# EAGLE design Controller (EAGLE 5.10)
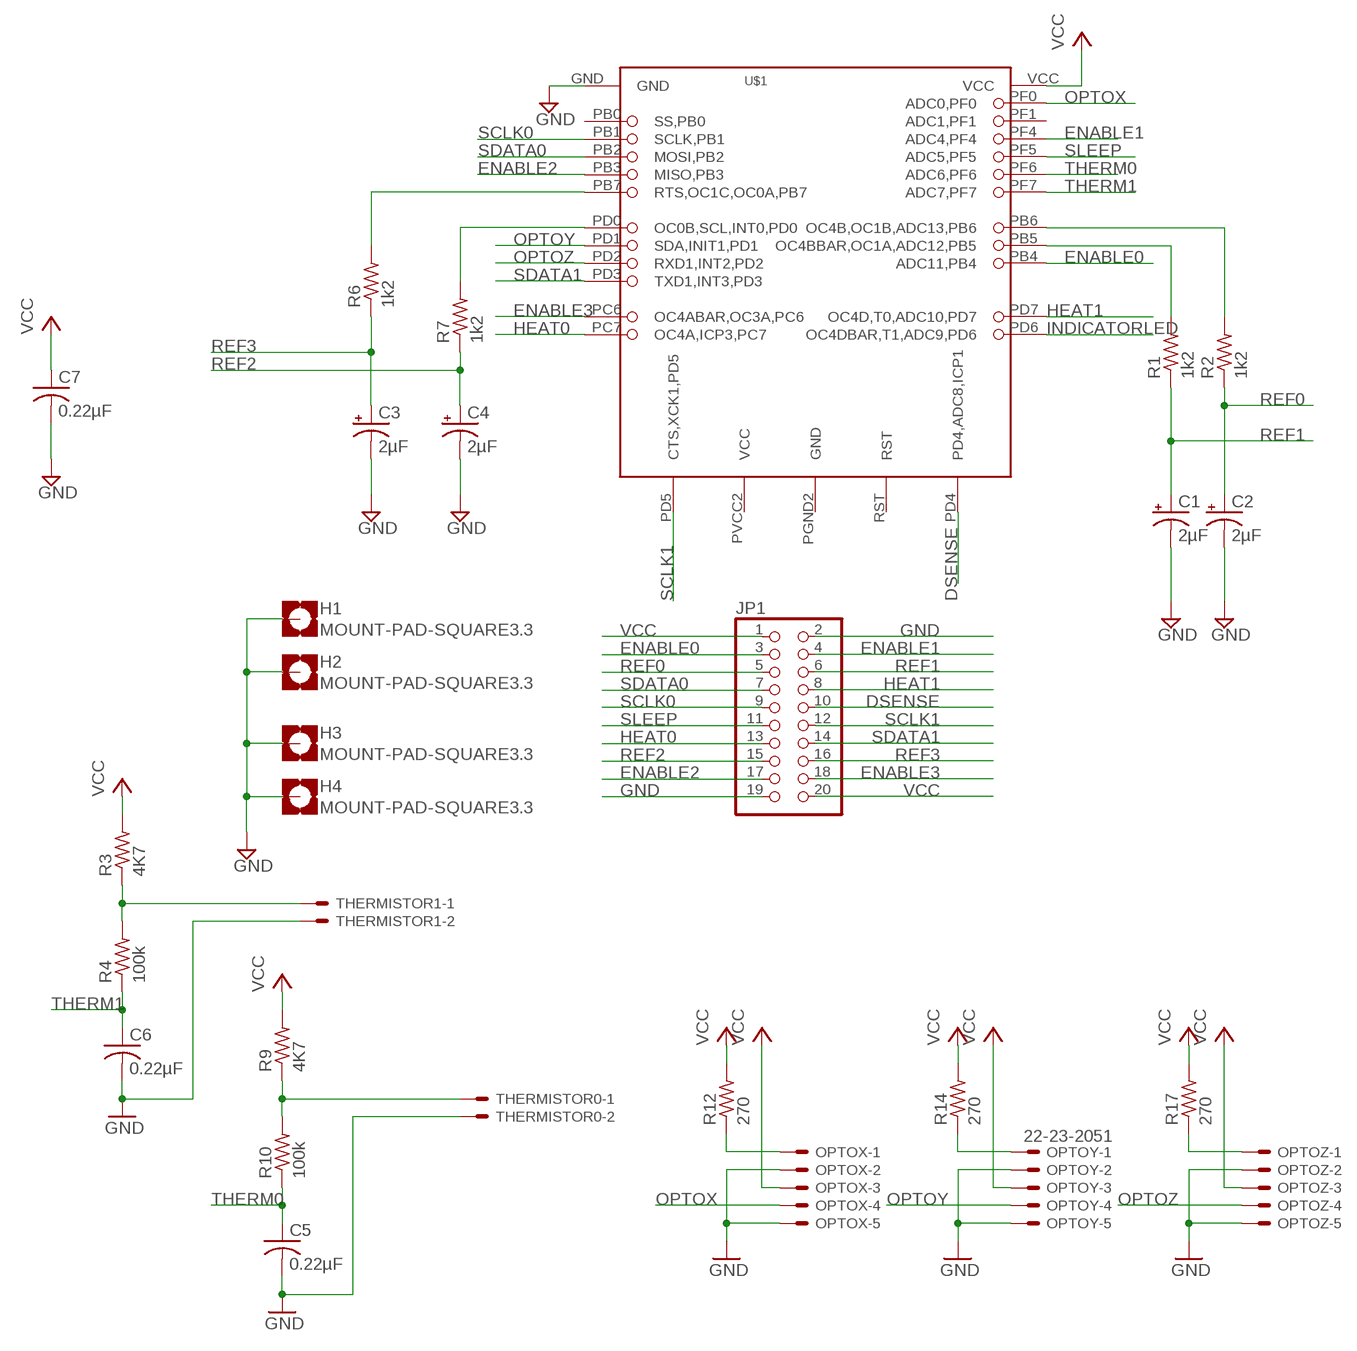
[diagram p0: schematic, sheet 1]

## Parts
C1  2µF  CPOL-USE2-5  [E2-5]
C2  2µF  CPOL-USE2-5  [E2-5]
C3  2µF  CPOL-USE2-5  [E2-5]
C4  2µF  CPOL-USE2-5  [E2-5]
C5  0.22µF  C-US050-025X075  [C050-025X075]
C6  0.22µF  C-US050-025X075  [C050-025X075]
C7  0.22µF  C-US050-025X075  [C050-025X075]
H1  MOUNT-PAD-SQUARE3.3  [3,3-PAD-SQUARE]
H2  MOUNT-PAD-SQUARE3.3  [3,3-PAD-SQUARE]
H3  MOUNT-PAD-SQUARE3.3  [3,3-PAD-SQUARE]
H4  MOUNT-PAD-SQUARE3.3  [3,3-PAD-SQUARE]
JP1  PINHD-2X10  [2X10]
OPTOX  22-23-2051  [22-23-2051]
OPTOY  22-23-2051  [22-23-2051]
OPTOZ  22-23-2051  [22-23-2051]
R1  1k2  R-US_0207/7  [0207/7]
R2  1k2  R-US_0207/7  [0207/7]
R3  4K7  R-US_0207/7  [0207/7]
R4  100k  R-US_0207/7  [0207/7]
R6  1k2  R-US_0207/7  [0207/7]
R7  1k2  R-US_0207/7  [0207/7]
R9  4K7  R-US_0207/7  [0207/7]
R10  100k  R-US_0207/7  [0207/7]
R12  270  R-US_0207/7  [0207/7]
R14  270  R-US_0207/7  [0207/7]
R17  270  R-US_0207/7  [0207/7]
THERMISTOR0  22-23-2021  [22-23-2021]
THERMISTOR1  22-23-2021  [22-23-2021]
U$1  TEENSY-EDGED  [TEENSY-NOINTERIOR]

## Nets
DSENSE: JP1.10 U$1.PD4(PD4,ADC8,ICP1)
ENABLE0: JP1.3 U$1.PB4(ADC11,PB4)
ENABLE1: JP1.4 U$1.PF4(ADC4,PF4)
ENABLE2: JP1.17 U$1.PB3(MISO,PB3)
ENABLE3: JP1.18 U$1.PC6(OC4ABAR,OC3A,PC6)
GND: C1.- C2.- C3.- C4.- C5.2 C6.2 C7.2 H1.B3,3(MOUNT) H2.B3,3(MOUNT) H3.B3,3(MOUNT) H4.B3,3(MOUNT) JP1.2 JP1.19 OPTOX.2 OPTOX.5 OPTOY.2 OPTOY.5 OPTOZ.2 OPTOZ.5 THERMISTOR0.2 THERMISTOR1.2 U$1.GND
HEAT0: JP1.13 U$1.PC7(OC4A,ICP3,PC7)
HEAT1: JP1.8 U$1.PD7(OC4D,T0,ADC10,PD7)
INDICATORLED: U$1.PD6(OC4DBAR,T1,ADC9,PD6)
N$1: R7.2 U$1.PD0(OC0B,SCL,INT0,PD0)
N$2: R6.2 U$1.PB7(RTS,OC1C,OC0A,PB7)
N$3: R1.2 U$1.PB5(OC4BBAR,OC1A,ADC12,PB5)
N$4: R2.2 U$1.PB6(OC4B,OC1B,ADC13,PB6)
N$7: R3.1 R4.2 THERMISTOR1.1
N$85: OPTOX.1 R12.1
N$86: OPTOY.1 R14.1
N$89: OPTOZ.1 R17.1
N$98: R9.1 R10.2 THERMISTOR0.1
OPTOX: OPTOX.4 U$1.PF0(ADC0,PF0)
OPTOY: OPTOY.4 U$1.PD1(SDA,INIT1,PD1)
OPTOZ: OPTOZ.4 U$1.PD2(RXD1,INT2,PD2)
REF0: C2.+ JP1.5 R2.1
REF1: C1.+ JP1.6 R1.1
REF2: C4.+ JP1.15 R7.1
REF3: C3.+ JP1.16 R6.1
SCLK0: JP1.9 U$1.PB1(SCLK,PB1)
SCLK1: JP1.12 U$1.PD5(CTS,XCK1,PD5)
SDATA0: JP1.7 U$1.PB2(MOSI,PB2)
SDATA1: JP1.14 U$1.PD3(TXD1,INT3,PD3)
SLEEP: JP1.11 U$1.PF5(ADC5,PF5)
THERM0: C5.1 R10.1 U$1.PF6(ADC6,PF6)
THERM1: C6.1 R4.1 U$1.PF7(ADC7,PF7)
VCC: C7.1 JP1.1 JP1.20 OPTOX.3 OPTOY.3 OPTOZ.3 R3.2 R9.2 R12.2 R14.2 R17.2 U$1.VCC
Unconnected: U$1.PB0(SS,PB0) U$1.PF1(ADC1,PF1) U$1.RST

## Power pins joined to a net without a drawn wire
GND: U$1.PGND2(GND)
VCC: U$1.PVCC2(VCC)

## Library data of the parts
C1-C4 = rcl:CPOL-US: POLARIZED CAPACITOR, American symbol
C5-C7 = rcl:C-US: CAPACITOR, American symbol
H1-H4 = holes:MOUNT-PAD-SQUARE: MOUNTING PAD, square
JP1 = pinhead:PINHD-2X10: PIN HEADER
OPTOX OPTOY OPTOZ = con-molex:22-23-2051: .100" (2.54mm) Center Header - 5 Pin
R1-R4 R6 R7 R9 R10 R12 R14 R17 = rcl:R-US_: RESISTOR, American symbol
THERMISTOR0 THERMISTOR1 = con-molex:22-23-2021: .100" (2.54mm) Center Header - 2 Pin
U$1 = teensy2:TEENSY-EDGED

## Board
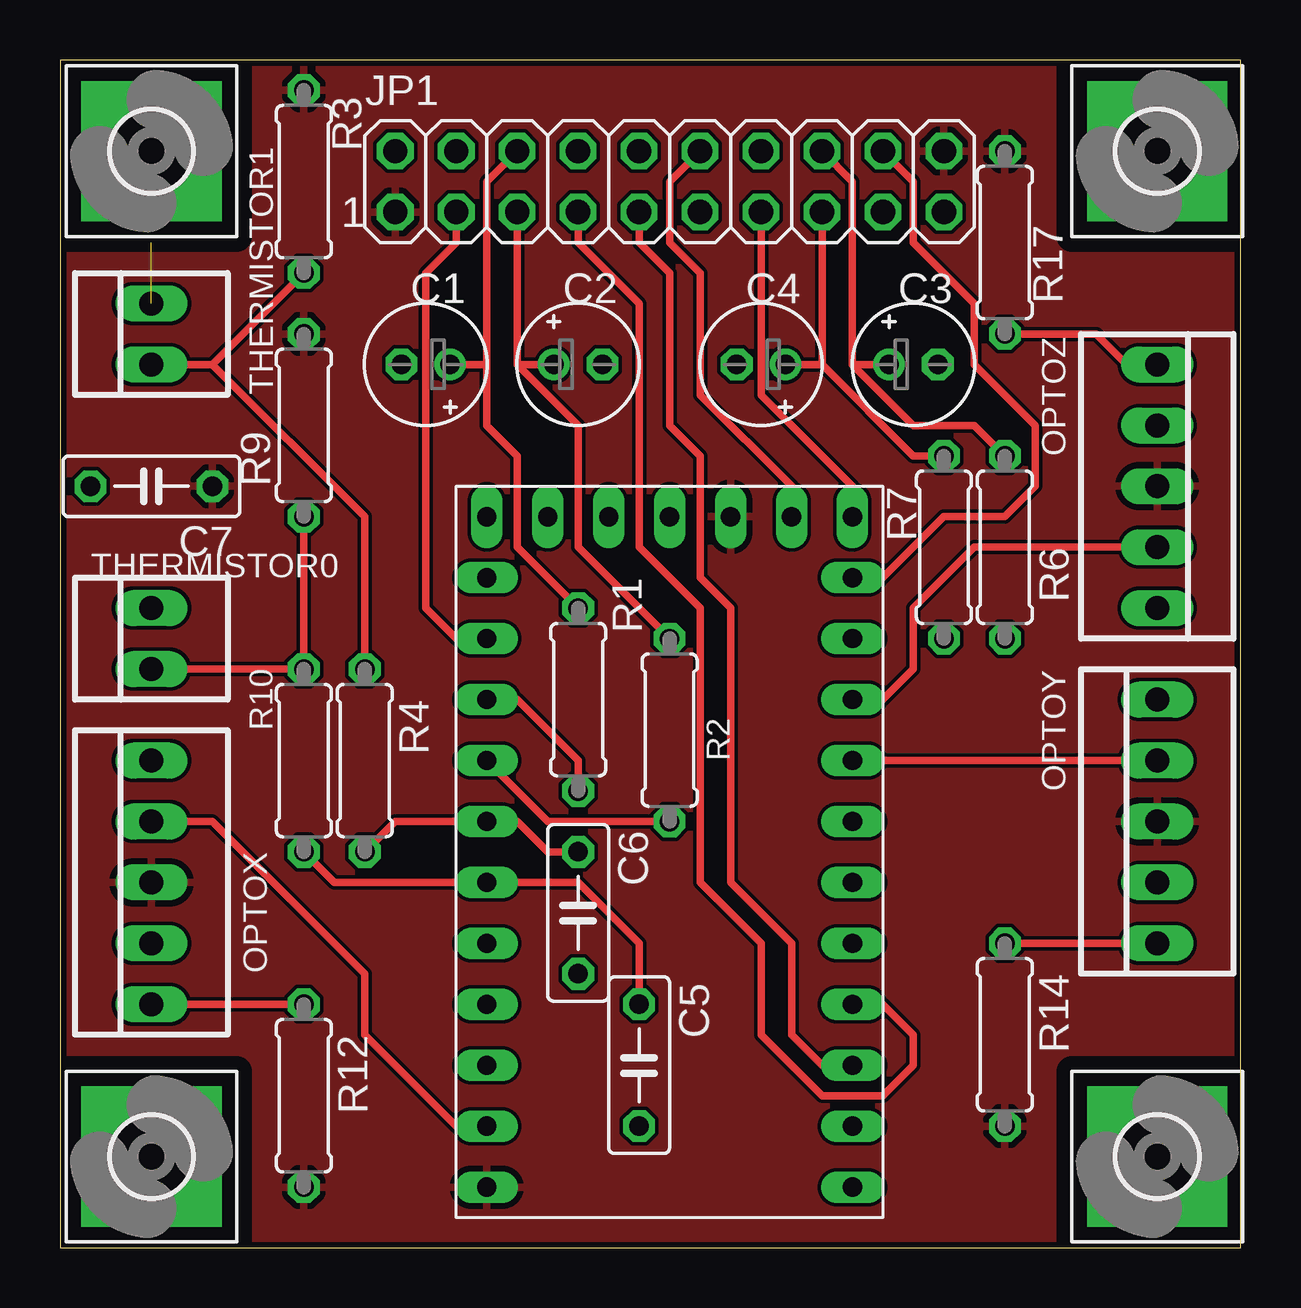
[diagram p1: board, top side]
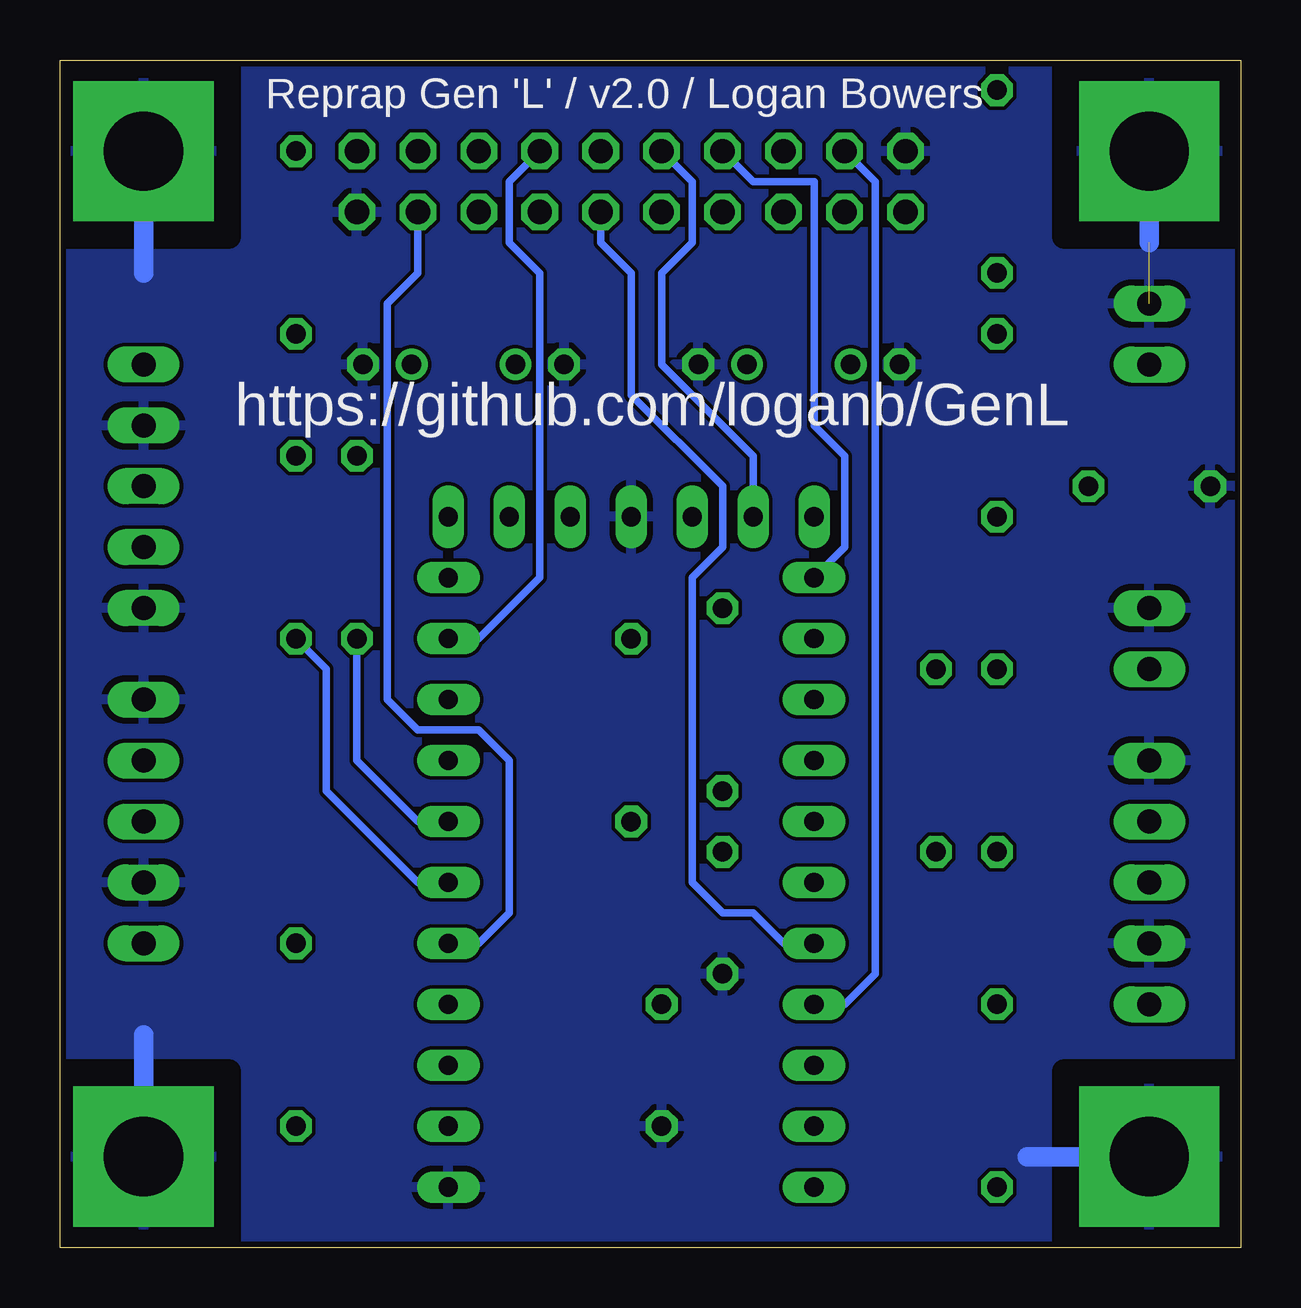
[diagram p2: board, bottom side, seen from below]

Size 49.2 x 49.52 mm. Coordinates in mm from the lower left corner, seen from the top.
Outline: 0,0 49.2,0 49.2,49.52 0,49.52 0,0
Copper layers (1*16): Top 0.035mm / dielectric 1.5mm / Bottom 0.035mm
Design rules "ITead_rule": minimum track width 6mil, minimum drill 12mil, track to track 6mil, track to pad 6mil, pad to pad 6mil, via to via 6mil, smd to smd 0mil, copper to edge 10mil, drill to drill 10mil, minimum pad ring 10mil, minimum via ring 6mil, stop-mask expansion 2mil, vias tented up to drill 100mil, thermal gap 10mil

### Footprints (pad centres in the part's own frame; a part is rotated, then mirrored left to right if it is on the bottom)
E2-5 = drill 0.813 pad 1.27 round: + -1.016,0 | drill 0.813 pad 1.27 octagon: - 1.016,0
C050-025X075 = drill 0.813 octagon: 1 -2.54,0; 2 2.54,0
3,3-PAD-SQUARE = drill 3.3 pad 5.842 square: B3,3 0,0
2X10 = drill 1.016 octagon: 1 -11.43,-1.27; 2 -11.43,1.27; 3 -8.89,-1.27; 4 -8.89,1.27; 5 -6.35,-1.27; 6 -6.35,1.27; 7 -3.81,-1.27; 8 -3.81,1.27; 9 -1.27,-1.27; 10 -1.27,1.27; 11 1.27,-1.27; 12 1.27,1.27; 13 3.81,-1.27; 14 3.81,1.27; 15 6.35,-1.27; 16 6.35,1.27; 17 8.89,-1.27; 18 8.89,1.27; 19 11.43,-1.27; 20 11.43,1.27
22-23-2051 = drill 1 long: 1 -5.08,0; 2 -2.54,0; 3 0,0; 4 2.54,0; 5 5.08,0
0207/7 = drill 0.813 octagon: 1 -3.81,0; 2 3.81,0
22-23-2021 = drill 1 long: 1 -1.27,0; 2 1.27,0
TEENSY-NOINTERIOR = drill 0.8 long: GND -7.62,13.97; PB0 -7.62,11.43; PB1 -7.62,8.89; PB2 -7.62,6.35; PB3 -7.62,3.81; PB4 7.62,-8.89; PB5 7.62,-6.35; PB6 7.62,-3.81; PB7 -7.62,1.27; PC6 -7.62,-11.43; PC7 -7.62,-13.97; PD0 -7.62,-1.27; PD1 -7.62,-3.81; PD2 -7.62,-6.35; PD3 -7.62,-8.89; PD4 5.08,-13.97; PD5 -5.08,-13.97; PD6 7.62,-13.97; PD7 7.62,-11.43; PF0 7.62,11.43; PF1 7.62,8.89; PF4 7.62,6.35; PF5 7.62,3.81; PF6 7.62,1.27; PF7 7.62,-1.27; PGND2 0,-13.97; PVCC2 -2.54,-13.97; RST 2.54,-13.97; VCC 7.62,13.97

### Placement (x,y rotation side)
C1  15.24,36.83 180 top
C2  21.59,36.83 0 top
C3  35.56,36.83 0 top
C4  29.21,36.83 180 top
C5  24.13,7.62 270 top
C6  21.59,13.97 270 top
C7  3.81,31.75 180 top
H1  3.81,45.72 0 top
H2  45.72,45.72 0 top
H3  3.81,3.81 0 top
H4  45.72,3.81 0 top
JP1  25.4,44.45 0 top
OPTOX  3.81,15.24 90 top
OPTOY  45.72,17.78 90 top
OPTOZ  45.72,31.75 270 top
R1  21.59,22.86 270 top
R2  25.4,21.59 270 top
R3  10.16,44.45 90 top
R4  12.7,20.32 90 top
R6  39.37,29.21 270 top
R7  36.83,29.21 270 top
R9  10.16,34.29 90 top
R10  10.16,20.32 90 top
R12  10.16,6.35 270 top
R14  39.37,8.89 270 top
R17  39.37,41.91 90 top
THERMISTOR0  3.81,25.4 90 top
THERMISTOR1  3.81,38.1 90 top
U$1  25.4,16.51 180 top

### Tracks (layer width: path | path; a pad name or v marks a point on that pad's centre or on a via)
DSENSE
  Bottom 0.305: JP1.10 22.86,44.45 22.86,41.91 24.13,40.64 24.13,36.83 20.32,33.02 U$1.PD4
ENABLE0
  Top 0.305: U$1.PB4 16.51,25.4 15.24,26.67 15.24,40.64 16.51,41.91 JP1.3
ENABLE1
  Bottom 0.305: JP1.4 15.24,44.45 15.24,11.43 16.51,10.16 U$1.PF4
ENABLE2
  Bottom 0.305: JP1.17 34.29,40.64 35.56,39.37 35.56,22.86 34.29,21.59 31.75,21.59 30.48,20.32 30.48,13.97 31.75,12.7 U$1.PB3
ENABLE3
  Top 0.305: U$1.PC6 34.29,27.94 36.83,30.48 39.37,30.48 40.64,31.75 40.64,34.29 38.1,36.83 38.1,39.37 35.56,41.91 35.56,44.45 JP1.18
GND  (1 unrouted)
  Bottom 0.813: 45.72,40.64 H2.B3,3 | 3.81,41.91 H1.B3,3 | H3.B3,3 8.89,3.81 | H4.B3,3 45.72,8.89
  pour Bottom: -2.54,-2.54 52.07,-2.54 52.07,52.07 -2.54,52.07
HEAT0
  Top 0.305: U$1.PC7 33.02,31.75 29.21,35.56 JP1.13
HEAT1
  Bottom 0.305: U$1.PD7 16.51,29.21 16.51,33.02 17.78,34.29 17.78,44.45 20.32,44.45 JP1.8
N$1
  Bottom 0.305: R7.2 36.83,20.32 34.29,17.78 U$1.PD0
N$2
  Bottom 0.305: R6.2 38.1,24.13 38.1,19.05 34.29,15.24 U$1.PB7
N$3
  Top 0.305: R1.2 21.59,20.32 19.05,22.86 U$1.PB5
N$4
  Top 0.305: U$1.PB6 20.32,17.78 R2.2
N$7
  Top 0.305: 6.35,36.83 THERMISTOR1.1 | 6.35,36.83 R3.1 | R4.2 12.7,30.48 6.35,36.83
N$85
  Top 0.305: OPTOX.1 R12.1
N$86
  Top 0.305: R14.1 OPTOY.1
N$89
  Top 0.305: R17.1 43.18,38.1 44.45,36.83 OPTOZ.1
N$98
  Top 0.305: THERMISTOR0.1 R10.2 R9.1
OPTOX
  Top 0.305: U$1.PF0 16.51,5.08 12.7,8.89 12.7,11.43 6.35,17.78 OPTOX.4
OPTOY
  Top 0.305: U$1.PD1 OPTOY.4
OPTOZ
  Top 0.305: U$1.PD2 34.29,22.86 35.56,24.13 35.56,26.67 38.1,29.21 OPTOZ.4
REF0
  Top 0.305: 19.05,36.83 21.59,34.29 21.59,29.21 R2.1 | 19.05,36.83 JP1.5 | 19.05,36.83 C2.+
REF1
  Top 0.305: R1.1 19.05,29.21 19.05,33.02 17.78,34.29 17.78,36.83 | 17.78,36.83 17.78,44.45 JP1.6 | 17.78,36.83 C1.+
REF2
  Top 0.305: R7.1 35.56,33.02 31.75,36.83 | 31.75,36.83 JP1.15 | C4.+ 31.75,36.83
REF3
  Top 0.305: R6.1 38.1,34.29 35.56,34.29 33.02,36.83 | 33.02,36.83 33.02,44.45 JP1.16 | C3.+ 33.02,36.83
SCLK0
  Top 0.305: JP1.9 24.13,41.91 25.4,40.64 25.4,34.29 26.67,33.02 26.67,27.94 27.94,26.67 27.94,15.24 30.48,12.7 30.48,8.89 31.75,7.62 U$1.PB1
SCLK1
  Top 0.305: U$1.PD5 30.48,31.75 26.67,35.56 26.67,40.64 25.4,41.91 25.4,44.45 JP1.12
SDATA0
  Top 0.305: JP1.7 21.59,41.91 24.13,39.37 24.13,29.21 26.67,26.67 26.67,15.24 29.21,12.7 29.21,8.89 31.75,6.35 34.29,6.35 35.56,7.62 35.56,8.89 34.29,10.16 U$1.PB2
SDATA1
  Bottom 0.305: JP1.14 30.48,44.45 30.48,41.91 29.21,40.64 29.21,27.94 31.75,25.4 U$1.PD3
SLEEP
  Bottom 0.305: JP1.11 26.67,41.91 25.4,40.64 25.4,35.56 21.59,31.75 21.59,29.21 22.86,27.94 22.86,15.24 21.59,13.97 20.32,13.97 19.05,12.7 U$1.PF5
THERM0
  Top 0.305: R10.1 11.43,15.24 U$1.PF6 21.59,15.24 24.13,12.7 C5.1
THERM1
  Top 0.305: R4.1 13.97,17.78 U$1.PF7 19.05,17.78 20.32,16.51 C6.1
VCC
  pour Top (isolate 0.127): -1.27,50.8 50.8,50.8 50.8,-1.27 -1.27,-1.27

### Text on the board
bNames: Reprap Gen 'L' / v2.0 / Logan Bowers | https://github.com/loganb/GenL
tValues: 1